# Altium schematic sheet PowerRegulator.SchDoc
size A4
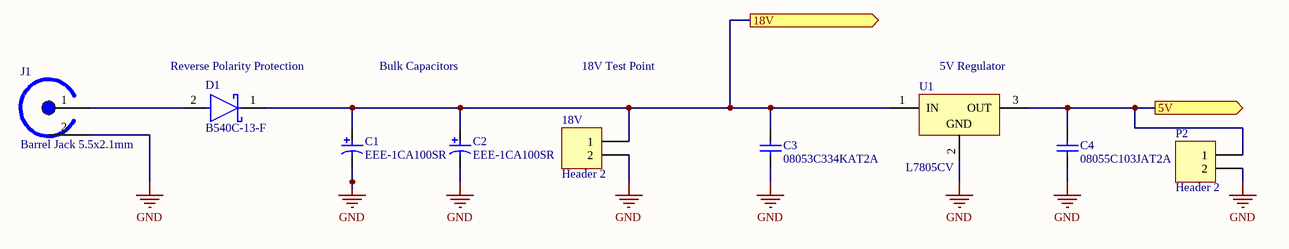
[diagram p0: PowerRegulator.SchDoc]

## Parts
18V  Header 2  [HDR1X2]
C1  EEE-1CA100SR  [PNSC-EEE1CA100SR_L]
C2  EEE-1CA100SR  [PNSC-EEE1CA100SR_L]
C3  08053C334KAT2A  [CAPC2013X140X50NL20T25]
C4  08055C103JAT2A  [CAPC2013X94X50ML20T25]
D1  B540C-13-F  [FP-SMC-MFG]
J1  Barrel Jack 5.5x2.1mm  [Barrel Jack 2.1x5.5mm THT]
P2  Header 2  [HDR1X2]
U1  L7805CV  [TO220]

## Ports
5V (out), 18V (out)

## Nets
GND: 18V.2 C1.2 C2.2 C3.2 C4.1 J1.2(SLEEVE) P2.2 U1.2(GND)
5V: C4.2 P2.1 U1.3(OUT) ; port 5V
18V: 18V.1 C1.1 C2.1 C3.1 D1.1(C) U1.1(IN) ; port 18V
NetD1_2: D1.2(A) J1.1(TIP)

## Notes on the sheet
- (near D1) Reverse Polarity Protection
- Bulk Capacitors
- 18V Test Point
- (near U1) 5V Regulator

## Library data of the parts
18V P2 = Header 2: Header, 2-Pin; LatestRevisionDate: 17-Jul-2002; LatestRevisionNote: Re-released for DXP Platform.; Publisher: Altium Limited
C1 C2 = CMP-2000-06199-1: Aluminum Electrolytic Capacitor, 10 uF, +/- 20%, -40 to 85 degC, 2-Pin SMD, RoHS, Tape and Reel; Manufacturer: Panasonic; Lead Length: 1.8mm; No. of Pins: 2; Ripple Current Frequency: 120Hz; Ripple Current Temperature: 85°C; External Depth: 4.3mm; Operating Lifetime: 2000h; Power Factor: 0.16; Lead Cross-section Width: 0.65mm; Product Range: PANASONIC-SSeries; Voltage Rating V DC: 16V; Leakage Current: 3µA; Ripple Current AC: 28mA; AE Capacitor Case: RadialCan-SMD; Capacitance: 10µF; Lifetime @ Temperature: 2000hours@85°C; External Length / Height: 5.4mm; SVHC: NoSVHC(16-Dec-2013); Packaging: CutTape; Series: VS; Package Description: 2-Pin Surface Mount Device, Body 4.5 x 4.5 mm; Tolerance -: 20%; Capacitor Terminals: SMD; Lead Spacing: 1mm; Package / Case: B; Capacitance Tolerance: ±20%; Operating life Time: 2000h; Tape Width: 12mm; Power Factor Frequency: 120Hz; Voltage Rating: 16V; Diameter: 4mm; Operating Temperature Max: 85°C; Datasheet URL: https://datasheet.ciiva.com/19458/1355487-19458346.pdf; Capacitor Mounting: SMD; External Width: 4.3mm; Operating Life Temperature: 85°C; Capacitance Tolerance ±: ±20%; Package Reference: EEE1CA100SR; AC Ripple Current: 28mA; Tolerance +: 20%; Height: 5.4mm; Datasheet Version: 04/2005; Operating Temperature Min: -40°C; Capacitor Case Style: RadialCan-SMD; Mounting Technology: SurfaceMount; Operating Temperature Range: -40°Cto+85°C; Manufacturer URL: http://www.panasonic.com/; Life Time @ Temperature: 2000hours@85°C
C3 = CMP-2007-04608-1: Manufacturer: AVX Interconnect / Elco; Part Number: 08053C334KAT2A
C4 = CMP-2007-04361-1: Manufacturer: AVX Interconnect / Elco; Part Number: 08055C103JAT2A
D1 = CMP-12790-000056-1: DIODE SCHOTTKY 40V 5A SMC; Manufacturer: Diodes Inc.; Automotive Grade: NA; Peak Reverse Current: 0.5mA; Value: 300pF; Max Junction Temp: +150°C; Max Surge Forward Current: 100A; Standoff Height: 0.1mm; Digikey Description: DIODE SCHOTTKY 40V 5A SMC; Temperature Range Low: -55°C; Manufacturer Part Number: B540C-13-F; Octopart: https://octopart.com/b540c-13-f-diodes+inc.-325873; Lead Free: Yes; Reverse Voltage: 40V; RoHS: TRUE; Category: Diode; Mouser Description: Diode: Schottky rectifying; SMD; 40V; 5A; SMC; Package: reel, tape; ComponentLink2Description: Datasheet; Temperature Range High: +150°C; Automotive: No; Footprint Url: https://www.diodes.com/assets/Package-Files/SMC.pdf; Device Class L3: Schottky Diodes; Height: 2.5mm; Forward Current: 5A; Temperature: -55°C to +150°C; Package: SMC; ComponentLink2URL: https://www.diodes.com/assets/Datasheets/ds13012.pdf; Device Class L2: Diodes; Max Repetitive Reverse Voltage: 40V; Device Class L1: Discrete Semiconductors; Capacitance: 300pF
J1 = Barrel Jack 5.5x2.1mm: GCT DCJ200-10-A-K1-K
U1 = CMP-0244-00483-1: Positive Voltage Regulator, 5V, 3-Pin TO-220; PackageDescription: TO, Thru-Hole, Vertical, Heatsink Mounted; 3 In-Line Leads; Pitch 2.54 mm; ComponentLink2Description: Datasheet; PackageReference: TO220; ComponentLink3URL: http://www.st.com/internet/com/TECHNICAL_RESOURCES/TECHNICAL_LITERATURE/PACKAGE_INFORMATION/CD00004649.pdf; DatasheetVersion: 16/11/2011; ComponentLink1Description: Manufacturer URL; ComponentLink1URL: http://www.st.com; PackageVersion: ver3.0; ComponentLink3Description: Package Specification; ComponentLink2URL: http://www.st.com/internet/com/TECHNICAL_RESOURCES/TECHNICAL_LITERATURE/DATASHEET/CD00000444.pdf